# EAGLE schematic Dimmer_Board_Rev_0.1 (EAGLE 8.4.0)
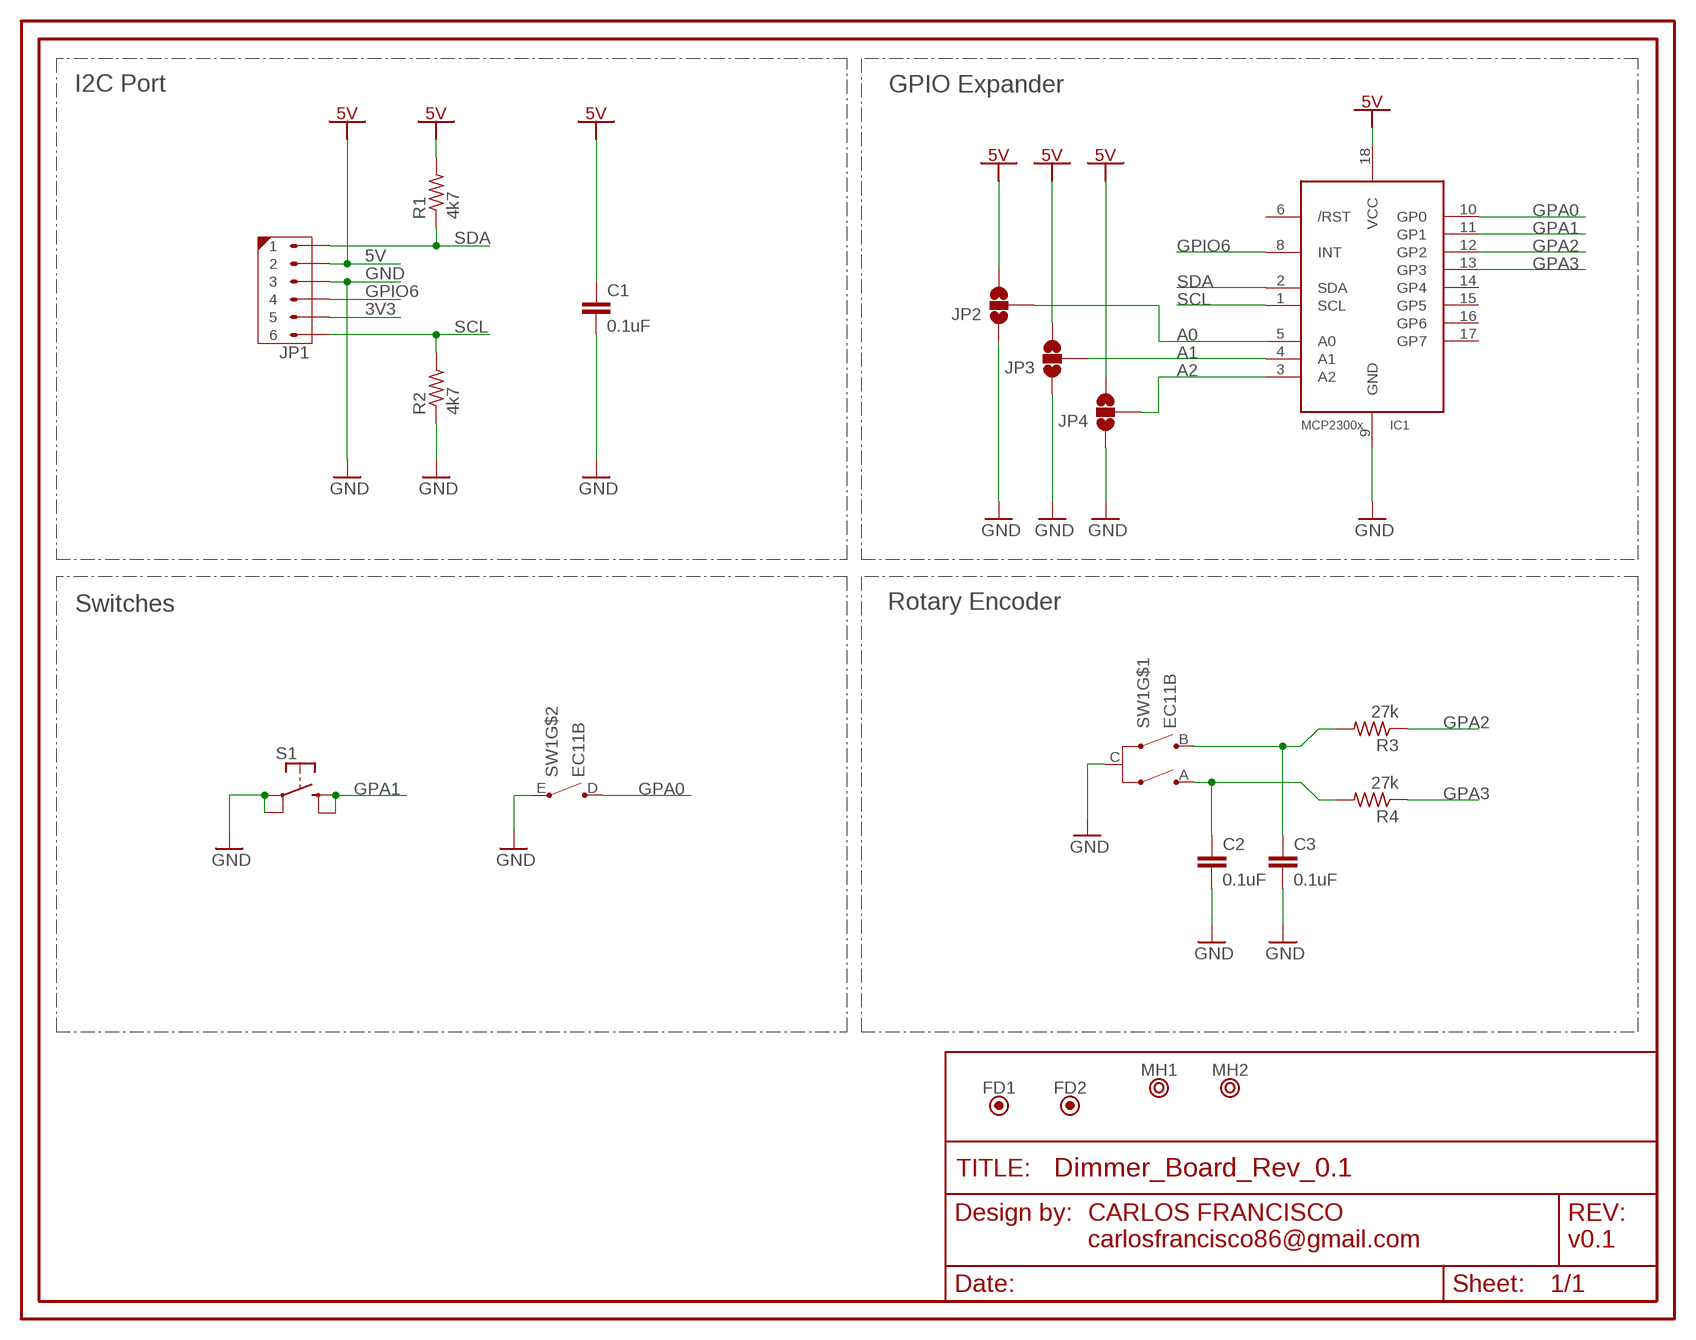
[diagram p0: schematic, sheet 1]

## Parts
C1  0.1uF  C-EUC0805  [C0805]
C2  0.1uF  C-EUC0805  [C0805]
C3  0.1uF  C-EUC0805  [C0805]
FD1  FIDUCIALBFID  [BOARD_FIDUCIAL]
FD2  FIDUCIALBFID  [BOARD_FIDUCIAL]
IC1  MCP23008/SO  [SO18W]
JP1  6X1THT_254MM  [HDRV6W63P254_6X1_1520X280H680]
JP2  JUMPER-SMT_3_NO_SILK  [SMT-JUMPER_3_NO_SILK]
JP3  JUMPER-SMT_3_NO_SILK  [SMT-JUMPER_3_NO_SILK]
JP4  JUMPER-SMT_3_NO_SILK  [SMT-JUMPER_3_NO_SILK]
MH1  MOUNTING_HOLE3.5MM  [MTGP500H350]
MH2  MOUNTING_HOLE3.5MM  [MTGP500H350]
R1  4k7  R-US_R0805  [R0805]
R2  4k7  R-US_R0805  [R0805]
R3  27k  R-US_R0805  [R0805]
R4  27k  R-US_R0805  [R0805]
S1  BUTTON-4KSC  [KSC_X]
SW1  EC11B  EC11B-V-T  [EC11B-V]

## Nets
3V3: JP1.5
5V: C1.1 IC1.18(VCC) JP1.2 JP2.3 JP3.3 JP4.3 R1.2
A: C2.1 R4.2 SW1.A
A0: IC1.5(A0) JP2.2
A1: IC1.4(A1) JP3.2
A2: IC1.3(A2) JP4.2
B: C3.1 R3.2 SW1.B
GND: C1.2 C2.2 C3.2 IC1.9(GND) JP1.3 JP2.1 JP3.1 JP4.1 R2.1 S1.1 S1.2 SW1.C SW1.E
GPA0: IC1.10(GP0) SW1.D
GPA1: IC1.11(GP1) S1.3 S1.4
GPA2: IC1.12(GP2) R3.1
GPA3: IC1.13(GP3) R4.1
GPIO6: IC1.8(INT) JP1.4
SCL: IC1.1(SCL) JP1.6 R2.2
SDA: IC1.2(SDA) JP1.1 R1.1
Unconnected: IC1.6(/RST) IC1.14(GP4) IC1.15(GP5) IC1.16(GP6) IC1.17(GP7) MH1.1 MH2.1

## Notes on the sheet
- I2C Port | GPIO Expander
- Switches | Rotary Encoder
- CARLOS FRANCISCO
  carlosfrancisco86@gmail.com
- v0.1

## Library data of the parts
C1-C3 = rcl:C-EU: CAPACITOR, European symbol
FD1 FD2 = Mtronik-Aesthetics:FIDUCIAL: FIDUCIAL Symbol
IC1 = adafruit:MCP23008: MCP23008 Inexpensive i2c i/o expander - 8 general purpose i/o pins with optional pullups
JP1 = Mtronik-connector:6X1
JP2-JP4 = SparkFun-Jumpers:JUMPER-SMT_3_NO: Normally open jumper This jumper has three pads in close proximity to each other. Apply solder to close the connection(s).
MH1 MH2 = Mtronik-Aesthetics:MOUNTING_HOLE: MOUNTING HOLE Symbol
R1-R4 = rcl:R-US_: RESISTOR, American symbol
S1 = CoachManAir:BUTTON-4
SW1 = alps:EC11B-V-T: ALPS EC11B Vertikal mit Taster Drehimpulsgeber 11mm